# EAGLE design ESR Meter v6 (EAGLE 7.4.0)
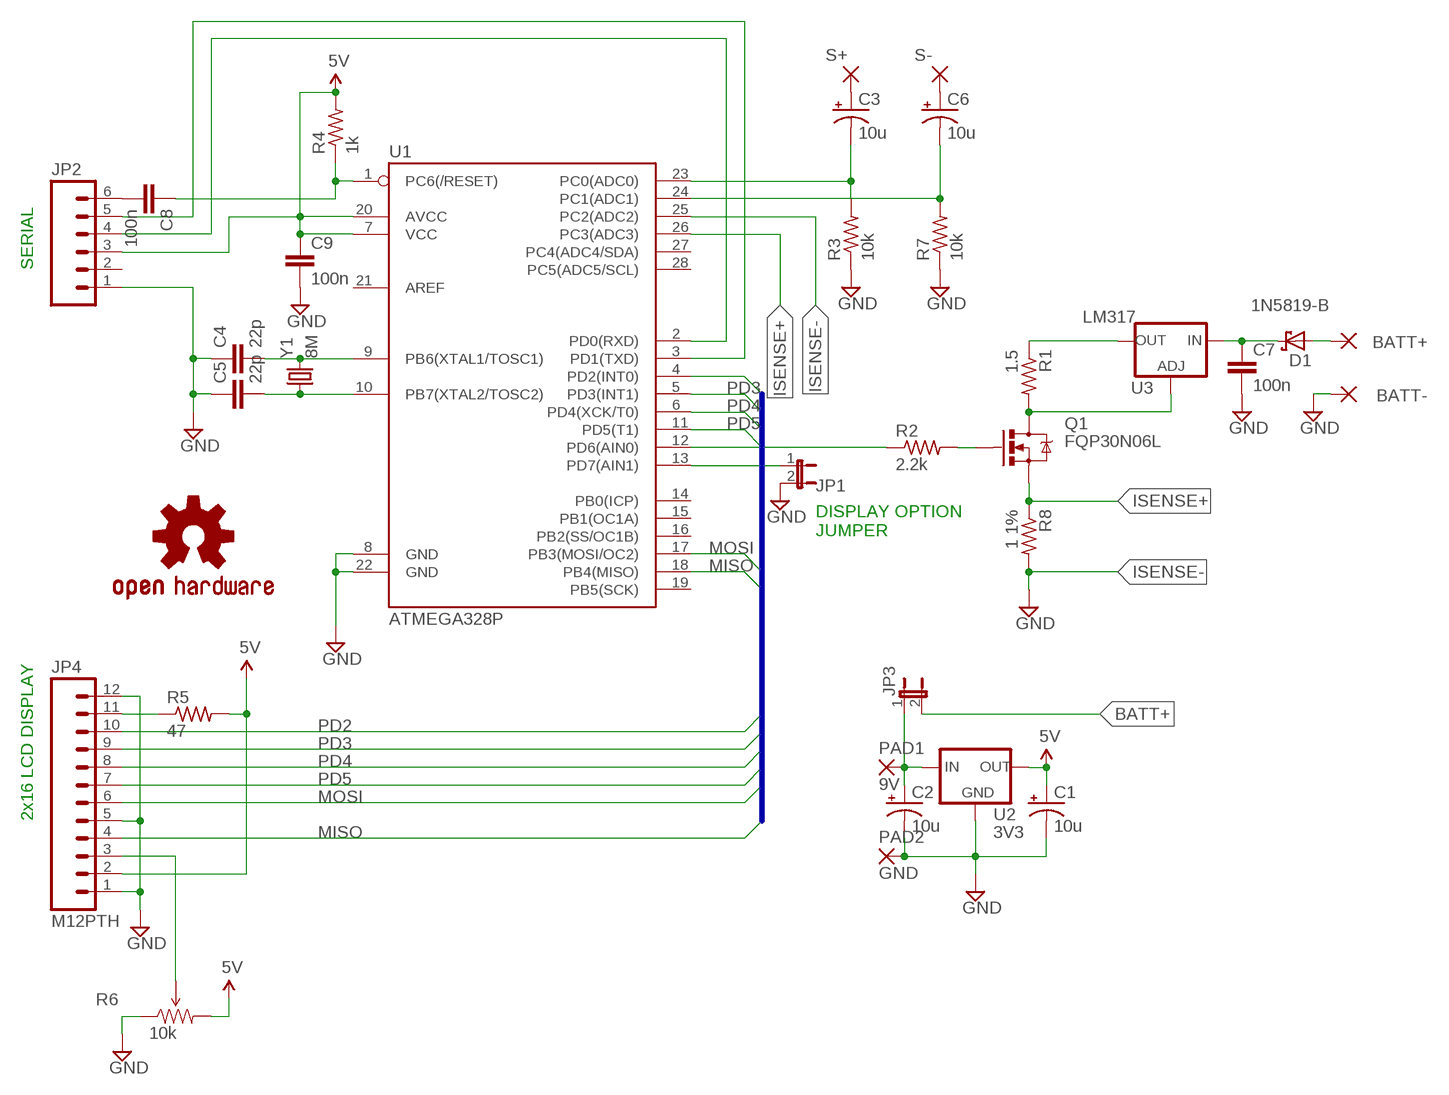
[diagram p0: schematic, sheet 1]

## Parts
BATT+  WIREPAD4,16O1,6  [4,16O1,6]
BATT-  WIREPAD4,16O1,6  [4,16O1,6]
C1  10u  CAP_POLPTH2  [CPOL-RADIAL-10UF-25V]
C2  10u  CAP_POLPTH2  [CPOL-RADIAL-10UF-25V]
C3  10u  CAP_POLPTH2  [CPOL-RADIAL-10UF-25V]
C4  22p  CAPEZ  [CAP-PTH-SMALLEZ]
C5  22p  CAPEZ  [CAP-PTH-SMALLEZ]
C6  10u  CAP_POLPTH2  [CPOL-RADIAL-10UF-25V]
C7  100n  CAPEZ  [CAP-PTH-SMALLEZ]
C8  100n  CAPEZ  [CAP-PTH-SMALLEZ]
C9  100n  CAPEZ  [CAP-PTH-SMALLEZ]
D1  1N5819-B  [DO41-7.6]
JP1  JUMPER-2PTH  [1X02]
JP2  M06SILK_FEMALE_PTH  [1X06]
JP3  JUMPER-2PTH  [1X02]
JP4  M12PTH  [1X12]
LOGO1  OSHW-LOGOM  [OSHW-LOGO-M]
PAD1  9V  1,6/0,9  [1,6/0,9]
PAD2  GND  1,6/0,9  [1,6/0,9]
Q1  FQP30N06L  MOSFET-NCHANNELFQP30N06L  [TO220V]
R1  1.5  R-US_0617/5V  [0617V]
R2  2.2k  R-US_0207/10  [0207/10]
R3  10k  R-US_0207/10  [0207/10]
R4  1k  R-US_0207/10  [0207/10]
R5  47  R-US_0207/10  [0207/10]
R6  10k  TRIMPOT-PTH-KNOB  [3386U]
R7  10k  R-US_0207/10  [0207/10]
R8  1 1%  R-US_0617/5V  [0617V]
S+  SENSE  2,15/1,0  [2,15/1,0]
S-  SENSE  2,15/1,0  [2,15/1,0]
U1  ATMEGA328P  ATMEGA328P_PDIP  [DIL28-3]
U2  3V3  L4931  [L4931]
U3  LM317  V_REG_317SINK  [TO220-ADJ]
Y1  8M  CRYSTALHC49US  [HC49US]

## Nets
5V [Supply]: C1.1(+) C9.1 JP2.3 JP4.2 R4.2 R5.2 R6.3(CW) U1.7(VCC) U1.20(AVCC) U2.OUT
BATT+ [HV]: BATT+.1(P) D1.A JP3.2
GND [Grounds]: BATT-.1(P) C1.2(-) C2.2(-) C4.1 C5.1 C7.2 C9.2 JP1.2 JP2.1 JP4.1 JP4.5 JP4.12 PAD2.1(P) R3.1 R6.1(CCW) R7.1 R8.2 U1.8(GND) U1.22(GND) U2.GND
ISENSE+ [Grounds]: Q1.3(S) R8.1 U1.26(PC3(ADC3))
ISENSE-: U1.25(PC2(ADC2))
MISO: JP4.4 U1.18(PB4(MISO))
MOSI: JP4.6 U1.17(PB3(MOSI/OC2))
N$1: Q1.1(G) R2.2
N$2 [HV]: Q1.2(D) R1.2 U3.ADJ
N$4: R2.1 U1.12(PD6(AIN0))
N$5: C3.2(-) R3.2 U1.23(PC0(ADC0))
N$6 [HV]: C2.1(+) JP3.1 PAD1.1(P) U2.IN
N$7: C4.2 U1.9(PB6(XTAL1/TOSC1)) Y1.2
N$8: C5.2 U1.10(PB7(XTAL2/TOSC2)) Y1.1
N$9: JP4.3 R6.2(WIPER)
N$10: C8.2 JP2.6
N$11: JP2.5 U1.3(PD1(TXD))
N$12: JP2.4 U1.2(PD0(RXD))
N$13: C3.1(+) S+.1(P)
N$14: JP4.11 R5.1
N$15: C6.1(+) S-.1(P)
N$16: JP1.1 U1.13(PD7(AIN1))
N$17: C6.2(-) R7.2 U1.24(PC1(ADC1))
N$18 [HV]: R1.1 U3.OUT
N$100 [HV]: C7.1 D1.C U3.IN
PD2: JP4.10 U1.4(PD2(INT0))
PD3: JP4.9 U1.5(PD3(INT1))
PD4: JP4.8 U1.6(PD4(XCK/T0))
PD5: JP4.7 U1.11(PD5(T1))
RESET: C8.1 R4.1 U1.1(PC6(/RESET))
Unconnected: JP2.2 U1.14(PB0(ICP)) U1.15(PB1(OC1A)) U1.16(PB2(SS/OC1B)) U1.19(PB5(SCK)) U1.21(AREF) U1.27(PC4(ADC4/SDA)) U1.28(PC5(ADC5/SCL))

## Buses
PD[2..5],MISO,MOSI

## Notes on the sheet
- SERIAL
- DISPLAY OPTION
  JUMPER
- 2x16 LCD DISPLAY

## Library data of the parts
BATT+ BATT- = wirepad:WIREPAD: Wire PAD connect wire on PCB
C1-C3 C6 = SparkFun-Capacitors:CAP_POL: Capacitor Polarized These are standard SMD and PTH capacitors. Normally 10uF, 47uF, and 100uF in electrolytic and tantalum varieties. Always verify the external diameter of the through hole cap, it varies with capacity, voltage, and manufacturer. The EIA devices should be standard.
C4 C5 C7-C9 = SparkFun-Capacitors:CAP: Capacitor Standard 0603 ceramic capacitor, and 0.1" leaded capacitor.
D1 = diode:1N581*: 1.0A SCHOTTKY BARRIER RECTIFIER Source: http://www.diodes.com/datasheets/ds23001.pdf
JP1 JP3 = SparkFun-Retired:JUMPER-2: Jumper Basic 0.1" spaced jumper. Use with breakaway headers.
JP2 = SparkFun-Connectors:M06: Header 6 Standard 6-pin 0.1" header. Use with straight break away headers (SKU : PRT-00116), right angle break away headers (PRT-00553), swiss pins (PRT-00743), machine pins (PRT-00117), and female headers (PRT-00115). Molex polarized connector foot print use with SKU : PRT-08094 with associated crimp pins and housings. NOTES ON THE VARIANTS LOCK and LOCK_LONGPADS... This footprint was designed to help hold the alignment of a through-hole component (i.e. 6-pin header) while soldering it into place. You may notice that each hole has been shifted either up or down by 0.005 of an inch from it's more standard position (which is a perfectly straight line). This slight alteration caused the pins (the squares in the middle) to touch the edges of the holes. Because they are alternating, it causes a "brace" to hold the component in place. 0.005 has proven to be the perfect amount of "off-center" position when using our standard breakaway headers. Although looks a little odd when you look at the bare footprint, once you have a header in there, the alteration is very hard to notice. Also,if you push a header all the way into place, it is covered up entirely on the bottom side. This idea of altering the position of holes to aid alignment will be further integrated into the Sparkfun Library for other footprints. It can help hold any component with 3 or more connection pins.; PROD_ID: CONN-08437
JP4 = SparkFun-Connectors:M12: Header 12 Standard 12-pin 0.1" header. Use with straight break away headers (SKU : PRT-00116), right angle break away headers (PRT-00553), swiss pins (PRT-00743), machine pins (PRT-00117), and female headers (PRT-00115).
LOGO1 = SparkFun-Aesthetics:OSHW-LOGO: Open Source Hardware Logo This logo indicates the piece of hardware it is found on incorporates a OSHW license and/or adheres to the definition of open source hardware found here: http://freedomdefined.org/OSHW
PAD1 PAD2 = wirepad:1,6/0,9: THROUGH-HOLE PAD
Q1 = SparkFun-DiscreteSemi:MOSFET-NCHANNEL: Common NMOSFET Parts MFG P/N Store ID Prod ID FDD8780 TRANS-09984 SI7820DN TRANS-11055 FDS6630A IC-08089 2N7002PW TRANS-11151 FQP30N06L COM-10213 TRANS-10060 BSS123LT1G TRANS-08345 BSS138 TRANS-00830 BS170 2N7000; PROD_ID: TRANS-10060
R1-R5 R7 R8 = resistor:R-US_: RESISTOR, American symbol
R6 = SparkFun-Electromechanical:TRIMPOT: Various small potentiometers for "set-and-forget" applications
S+ S- = wirepad:2,15/1,0: THROUGH-HOLE PAD
U1 = SparkFun-DigitalIC:ATMEGA328P_PDIP: uC used in the Arduino 32kb flash, 1k EEPROM, 2k SRAM This is the through-hole version of this chip.
U2 = l4931:L4931: VOLTAGE REGULATOR
U3 = SparkFun-PowerIC:V_REG_317: Voltage Regulator Standard LM317 adjustable voltage regulator. AOI (Adjust Output Input). Google 'LM317 Calculator' for easy to use app to get the two resistor values needed. 240/720 for 5V output. 240/390 for 3.3V output. Spark Fun Electronics SKU : COM-00527
Y1 = SparkFun-FreqCtrl:CRYSTAL: Various standard crystals. Proven footprints.

## Net classes
1 Supply: width 0.61 mm
2 Grounds: width 0.61 mm, clearance 0.61 mm to class 1
3 HV: width 0.61 mm, clearance 0.914 mm to class 2

## Board
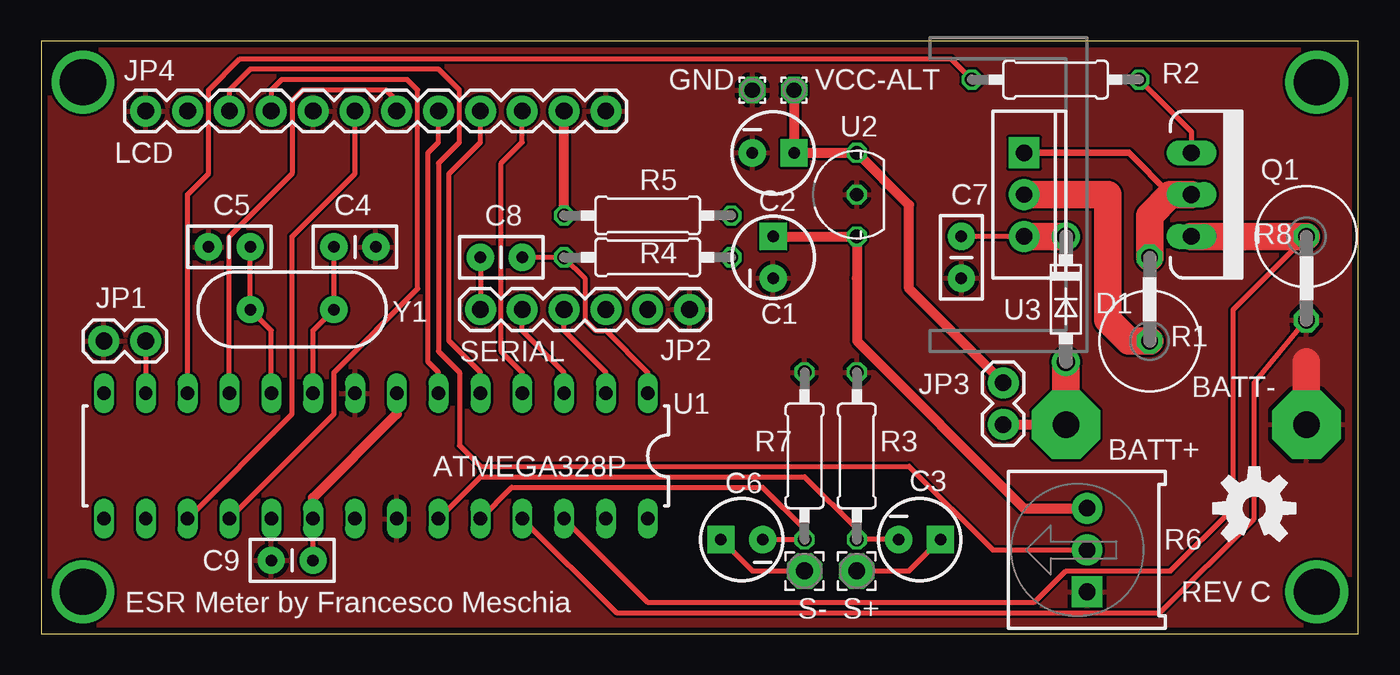
[diagram p1: board, top side]
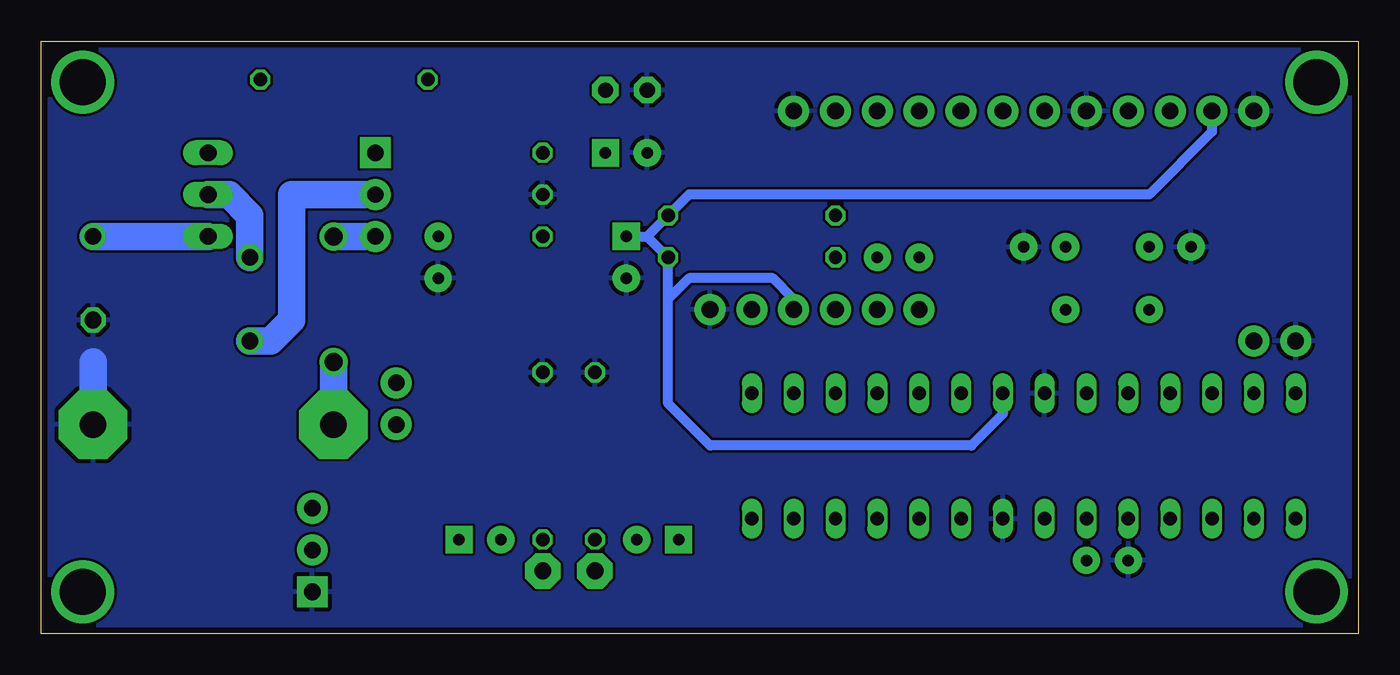
[diagram p2: board, bottom side, seen from below]

Size 79.98 x 35.99 mm. Coordinates in mm from the lower left corner, seen from the top.
Outline: 0,0 79.98,0 79.98,35.99 0,35.99 0,0
Copper layers (1*16): Top 0.0356mm / dielectric 1.5011mm / Bottom 0.0356mm
Design rules "oshpark-2layer": minimum track width 6mil, minimum drill 13mil, track to track 6mil, track to pad 6mil, pad to pad 6mil, via to via 6mil, smd to smd 6mil, copper to edge 15mil, drill to drill 6mil, minimum pad ring 7mil, minimum via ring 7mil, stop-mask expansion 2.5mil, vias tented up to drill 0mil, thermal gap 10mil

### Footprints (pad centres in the part's own frame; a part is rotated, then mirrored left to right if it is on the bottom)
4,16O1,6 = drill 1.6 pad 4.166 octagon: 1 0,0
CPOL-RADIAL-10UF-25V = drill 0.7 pad 1.651 square: 1 1.27,0 | drill 0.7 pad 1.651: 2 -1.27,0
CAP-PTH-SMALLEZ = drill 0.7 pad 1.651: 1 0,0; 2 2.54,0
DO41-7.6 = drill 1.1 pad 1.7: A 3.81,0; C -3.81,0
1X02 = drill 1.016 pad 1.88: 1 0,0; 2 2.54,0
1X06 = drill 1.016 pad 1.88: 1 0,0; 2 2.54,0; 3 5.08,0; 4 7.62,0; 5 10.16,0; 6 12.7,0
1X12 = drill 1.016 pad 1.88: 1 0,0; 2 2.54,0; 3 5.08,0; 4 7.62,0; 5 10.16,0; 6 12.7,0; 7 15.24,0; 8 17.78,0; 9 20.32,0; 10 22.86,0; 11 25.4,0; 12 27.94,0
1,6/0,9 = drill 0.914 pad 1.6 octagon: 1 0,0
TO220V = drill 1.016 long: 1 -2.54,0; 2 0,0; 3 2.54,0
0617V = drill 1.016 octagon: 1 -2.54,0; 2 2.54,0
0207/10 = drill 0.813 octagon: 1 -5.08,0; 2 5.08,0
3386U = drill 1.016 pad 1.88 square: 1 -2.54,-0.015 | drill 1.016 pad 1.88: 2 0,-0.015; 3 2.54,-0.015
2,15/1,0 = drill 1.016 pad 2.159 octagon: 1 0,0
DIL28-3 = drill 0.813 long: 1 -16.51,-3.81; 2 -13.97,-3.81; 3 -11.43,-3.81; 4 -8.89,-3.81; 5 -6.35,-3.81; 6 -3.81,-3.81; 7 -1.27,-3.81; 8 1.27,-3.81; 9 3.81,-3.81; 10 6.35,-3.81; 11 8.89,-3.81; 12 11.43,-3.81; 13 13.97,-3.81; 14 16.51,-3.81; 15 16.51,3.81; 16 13.97,3.81; 17 11.43,3.81; 18 8.89,3.81; 19 6.35,3.81; 20 3.81,3.81; 21 1.27,3.81; 22 -1.27,3.81; 23 -3.81,3.81; 24 -6.35,3.81; 25 -8.89,3.81; 26 -11.43,3.81; 27 -13.97,3.81; 28 -16.51,3.81
L4931 = drill 0.813 octagon: GND 0,0; IN 2.54,0; OUT -2.54,0
TO220-ADJ = drill 1 pad 1.88 square: ADJ -2.54,0 | drill 1 pad 1.88: IN 2.54,0; OUT 0,0
HC49US = drill 0.7 pad 1.651: 1 -2.54,0; 2 2.54,0

### Placement (x,y rotation side)
BATT+  62.23,12.7 0 top
BATT-  76.83,12.7 0 top
C1  44.45,22.86 90 top
C2  44.45,29.21 0 top
C3  53.34,5.71 0 top
C4  20.32,23.5 180 top
C5  10.16,23.5 0 top
C6  42.55,5.71 180 top
C7  55.88,24.13 270 top
C8  29.21,22.86 180 top
C9  16.51,4.45 180 top
D1  62.23,20.32 270 top
JP1  6.35,17.78 180 top
JP2  39.37,19.68 180 top
JP3  58.42,15.24 270 top
JP4  6.35,31.75 0 top
LOGO1  73.66,7.62 0 top
PAD1  45.72,33.02 0 top
PAD2  43.18,33.02 0 top
Q1  69.85,26.67 270 top
R1  67.31,20.32 90 top
R2  61.59,33.66 0 top
R3  49.53,10.79 270 top
R4  36.83,22.86 0 top
R5  36.83,25.4 0 top
R6  63.5,5.08 90 top
R7  46.35,10.79 270 top
R8  76.83,21.59 270 top
S+  49.53,3.81 0 top
S-  46.35,3.81 0 top
U1  20.32,10.79 180 top
U2  49.53,26.67 90 top
U3  59.69,26.67 270 top
Y1  15.24,19.68 0 top

### Tracks (layer width: path | path; a pad name or v marks a point on that pad's centre or on a via)
5V
  Top 0.305: C9.1 U1.20
  Top 0.61: U1.20 16.51,8.26 21.59,13.34 U1.7 | R6.3 59.69,7.62 49.55,17.78 49.53,21.59 U2.OUT C1.1
  Bottom 0.61: U1.7 21.59,13.34 23.5,11.43 39.37,11.43 41.91,13.97 41.91,20.32 | 41.91,20.32 R4.2 43.18,24.13 | JP4.2 8.89,30.48 12.7,26.67 40.64,26.67 R5.2 43.18,24.13 | C1.1 43.18,24.13 | JP2.3 34.29,20.32 35.56,21.59 40.64,21.59 41.91,20.32
BATT+
  Top 0.61: JP3.2 61.59,12.7 62.23,13.34
  Top 1.676: BATT+.1 62.23,13.34 D1.A
  Bottom 1.676: D1.A BATT+.1
GND
  Top 1.676: BATT-.1 76.83,16.51
  Bottom 1.676: BATT-.1 76.83,16.51
  pour Bottom: 0,0 0,35.56 80.01,35.56 80.01,0
  pour Top: 0,0 0,35.56 80.01,35.56 80.01,0
ISENSE+
  Top 0.305: 71.12,24.13 Q1.3 | U1.26 36.83,1.91 60.33,1.91 62.23,3.81 68.58,3.81 72.39,7.62 72.39,19.68 R8.1
  Top 1.676: Q1.3 R8.1
  Bottom 1.676: Q1.3 R8.1
ISENSE-
  Top 0.305: U1.25 34.92,1.27 67.94,1.27 73.66,6.99 73.66,15.24 76.83,19.05
MISO
  Top 0.305: U1.18 17.78,13.34 17.78,15.88 22.86,20.95 22.86,33.02 22.23,33.66 14.61,33.66 13.97,33.02 JP4.4
MOSI
  Top 0.305: U1.17 15.24,13.34 15.24,24.13 19.05,27.94 JP4.6
N$1
  Top 0.305: R2.2 69.85,30.48 Q1.1
N$2
  Top 0.406: U3.ADJ 66.04,29.21 68.58,26.67
  Top 1.676: R1.2 67.31,25.4 68.58,26.67 Q1.2
  Bottom 1.676: Q1.2 68.58,26.67 67.31,25.4 R1.2
N$4
  Top 0.305: R2.1 55.24,34.92 12.06,34.92 10.16,33.02 10.16,27.94 8.89,26.67 U1.12
N$5
  Top 0.305: C3.2 R3.2 49.53,6.35 46.35,9.53 26.67,9.53 U1.23
N$6
  Top 0.61: PAD1.1 C2.1 U2.IN 52.7,26.04 52.7,20.95 JP3.1
N$7
  Top 0.305: U1.9 16.51,18.41 Y1.2 C4.2
N$8
  Top 0.305: U1.10 13.97,18.41 Y1.1 C5.2
N$9
  Top 0.305: R6.2 57.78,5.08 52.7,10.16 26.67,10.16 25.4,11.43 25.4,15.88 24.13,17.14 24.13,28.57 25.4,29.84 25.4,33.02 24.13,34.29 12.7,34.29 11.43,33.02 JP4.3
N$10
  Top 0.305: C8.2 JP2.6
N$11
  Top 0.305: U1.3 31.75,15.88 29.21,18.41 JP2.5
N$12
  Top 0.305: U1.2 34.29,15.88 31.75,18.41 JP2.4
N$13
  Top 0.305: C3.1 52.7,3.81 S+.1
N$14
  Top 0.61: R5.1 JP4.11
N$15
  Top 0.305: S-.1 43.18,3.81 C6.1
N$16
  Top 0.305: JP1.1 U1.13
N$17
  Top 0.305: C6.2 R7.2 46.35,6.35 43.81,8.89 28.57,8.89 U1.24
N$18
  Top 1.676: R1.1 66.04,17.78 64.77,19.05 64.77,26.67 U3.OUT
  Bottom 1.676: R1.1 66.04,17.78 64.77,19.05 64.77,26.67 U3.OUT
N$19  (via drill 2.8)
  other vias: 2.54,2.54
N$20  (via drill 2.8)
  other vias: 2.54,33.5
N$21  (via drill 2.8)
  other vias: 77.47,2.54
N$100
  Top 0.305: U3.IN C7.1
  Top 1.676: U3.IN D1.C
  Bottom 1.676: D1.C U3.IN
PD2
  Top 0.305: U1.4 29.21,15.88 27.94,17.14 27.94,28.57 29.21,29.84 JP4.10
PD3
  Top 0.305: U1.5 26.67,15.88 24.77,17.78 24.77,27.94 26.67,29.84 JP4.9
PD4
  Top 0.305: U1.6 24.13,15.88 23.5,16.51 23.5,29.21 24.13,29.84 JP4.8
PD5
  Top 0.305: U1.11 11.43,24.13 15.24,27.94 15.24,32.38 15.88,33.02 20.95,33.02 21.59,32.38 JP4.7
RESET
  Top 0.305: C8.1 R4.1 33.02,21.59 33.02,19.05 33.66,18.41 34.29,18.41 36.83,15.88 U1.1
VIA$1  (via drill 2.8)
  other vias: 77.47,33.5

### Text on the board
tNames: GND | VCC-ALT | LCD | U3 | SERIAL | REV C | ESR Meter by Francesco Meschia